# EAGLE design WiiExt (EAGLE 7.2.0)
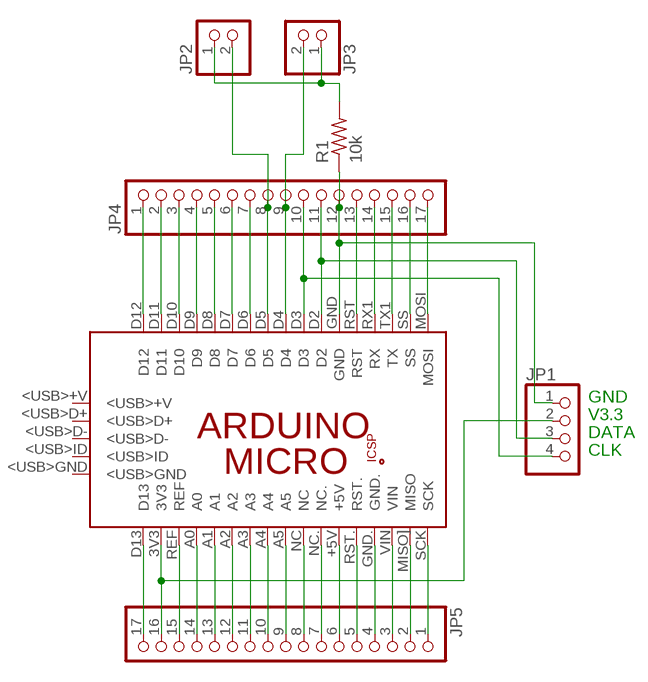
[diagram p0: schematic, sheet 1]

## Parts
JP1  PINHD-1X4  [1X04]
JP2  PINHD-1X2  [1X02]
JP3  PINHD-1X2  [1X02]
JP4  PINHD-1X17  [1X17]
JP5  PINHD-1X17  [1X17]
PCB1  ARDUINO_MICROOUTLINE  [ARDUINO_MICRO]
R1  10k  R-US_0204/7  [0204/7]

## Nets
N$1: JP1.4 JP4.10 PCB1.D3
N$2: JP1.3 JP4.11 PCB1.D2
N$3: JP1.1 JP4.12 PCB1.GND R1.1
N$4: JP1.2 JP5.16 PCB1.3V3
N$5: JP4.1 PCB1.D12
N$6: JP4.2 PCB1.D11
N$7: JP4.3 PCB1.D10
N$8: JP4.4 PCB1.D9
N$9: JP4.5 PCB1.D8
N$10: JP4.6 PCB1.D7
N$11: JP4.7 PCB1.D6
N$12: JP2.2 JP4.8 PCB1.D5
N$13: JP3.2 JP4.9 PCB1.D4
N$14: JP4.13 PCB1.RST
N$15: JP4.14 PCB1.RX1(RX)
N$16: JP4.15 PCB1.TX1(TX)
N$17: JP4.16 PCB1.SS
N$18: JP4.17 PCB1.MOSI
N$19: JP5.17 PCB1.D13
N$20: JP5.15 PCB1.REF
N$21: JP5.14 PCB1.A0
N$22: JP5.13 PCB1.A1
N$23: JP5.12 PCB1.A2
N$24: JP5.11 PCB1.A3
N$25: JP5.10 PCB1.A4
N$26: JP5.9 PCB1.A5
N$27: JP5.8 PCB1.NC
N$28: JP5.7 PCB1.NC.
N$29: JP5.6 PCB1.+5V
N$30: JP5.5 PCB1.RST.
N$31: JP5.4 PCB1.GND.
N$32: JP5.3 PCB1.VIN
N$33: JP5.2 PCB1.MISO](MISO)
N$34: JP5.1 PCB1.SCK
N$35: JP2.1 JP3.1 R1.2
Unconnected: PCB1.5V PCB1.<USB>+V PCB1.<USB>D+ PCB1.<USB>D- PCB1.<USB>GND PCB1.<USB>ID PCB1.GND_ PCB1.MISO. PCB1.MOSI. PCB1.RESET.. PCB1.SCK.

## Notes on the sheet
- GND
- V3.3
- DATA
- CLK

## Library data of the parts
JP1 = pinhead:PINHD-1X4: PIN HEADER
JP2 JP3 = pinhead:PINHD-1X2: PIN HEADER
JP4 JP5 = pinhead:PINHD-1X17: PIN HEADER
PCB1 = E14_Arduino_revB:ARDUINO_MICRO: Device for representing an Arduino Micro board with a footprint in an EAGLE design. Created by Dave Young for Element14. More EAGLE documentation at: http://www.element14.com/community/community/knode/cadsoft_eagle
R1 = resistor:R-US_: RESISTOR, American symbol

## Board
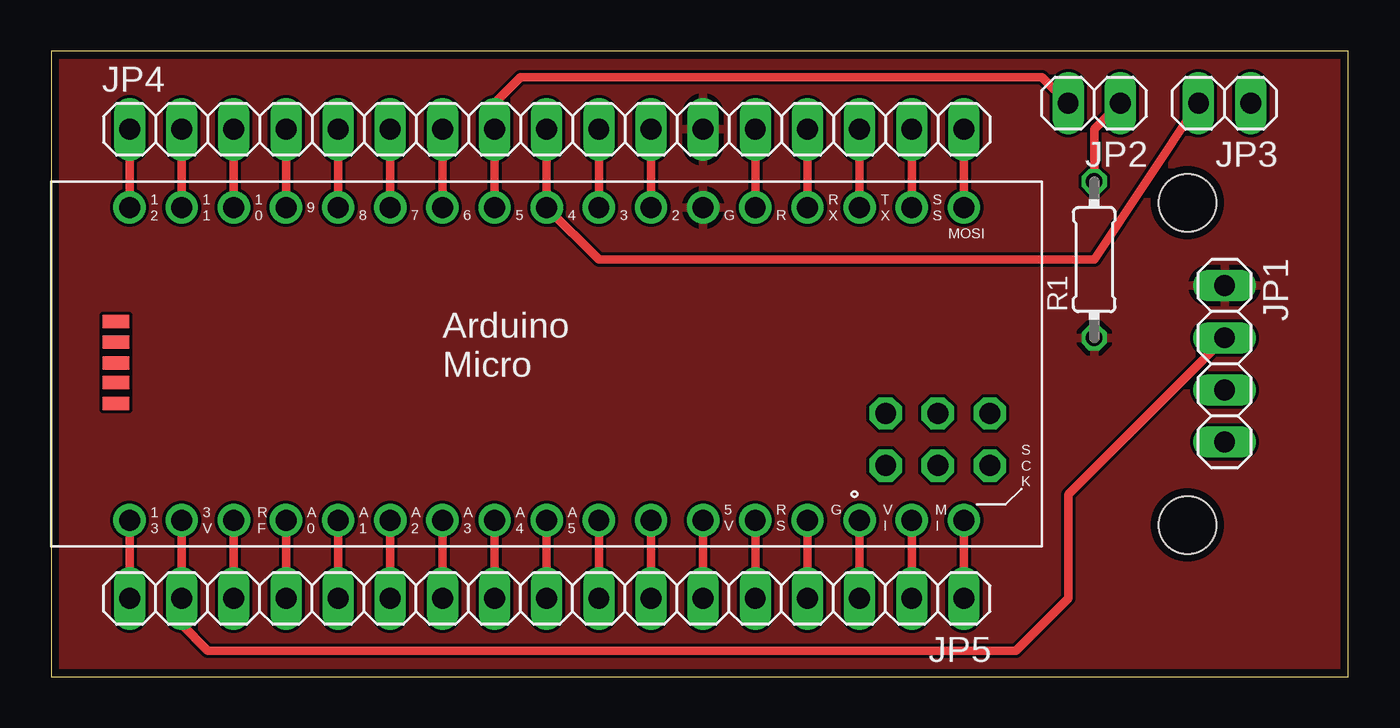
[diagram p1: board, top side]
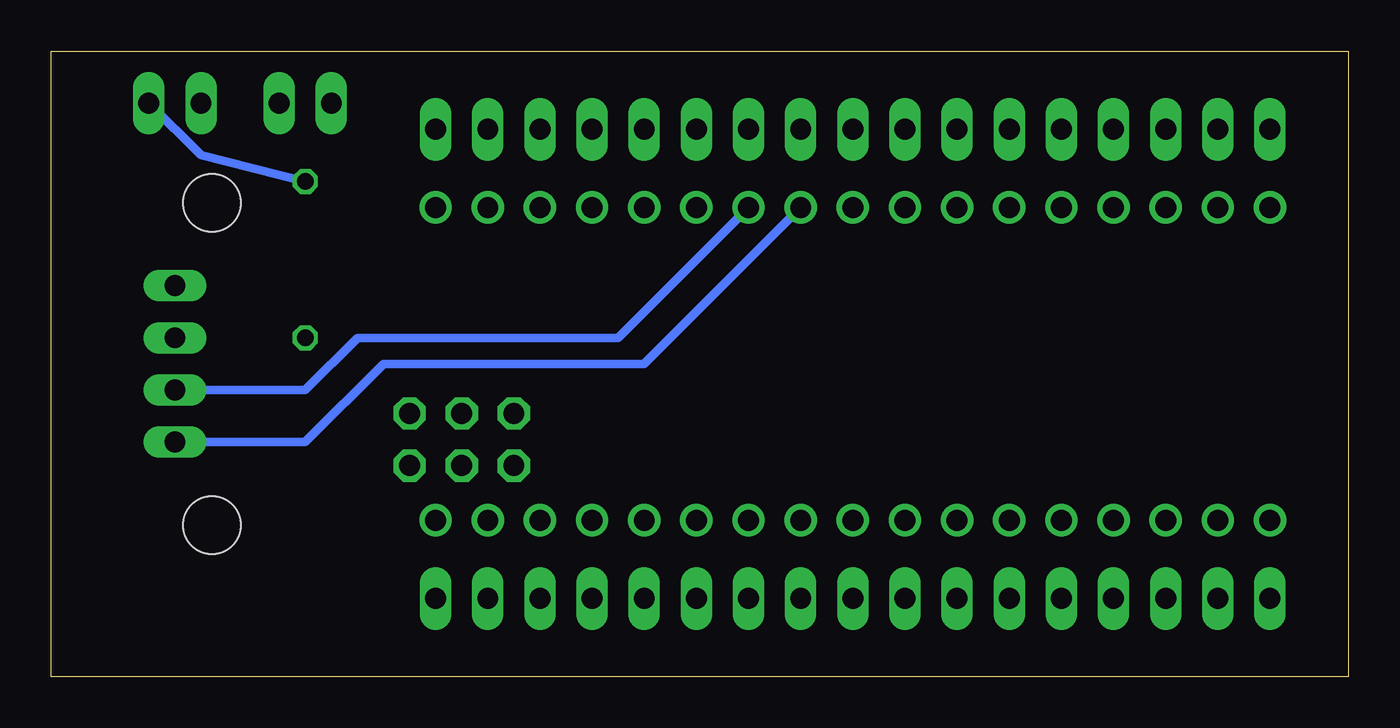
[diagram p2: board, bottom side, seen from below]

Size 63.17 x 30.47 mm. Coordinates in mm from the lower left corner, seen from the top.
Outline: 0,0 63.17,0 63.17,30.47 0,30.47 0,0
Copper layers (1*16): Top 0.0356mm / dielectric 1.5011mm / Bottom 0.0356mm
Design rules "LaenPCBOrder": minimum track width 6mil, minimum drill 13mil, track to track 6mil, track to pad 6mil, pad to pad 6mil, via to via 6mil, smd to smd 6mil, copper to edge 15mil, drill to drill 6mil, minimum pad ring 7mil, minimum via ring 7mil, stop-mask expansion 3mil, vias tented up to drill 0mil, thermal gap 10mil
Holes 2.8 mm at 55.34,23.09 55.34,7.39

### Footprints (pad centres in the part's own frame; a part is rotated, then mirrored left to right if it is on the bottom)
1X04 = drill 1.016 long: 1 -3.81,0; 2 -1.27,0; 3 1.27,0; 4 3.81,0
1X02 = drill 1.016 long: 1 -1.27,0; 2 1.27,0
1X17 = drill 1.016 long: 1 -20.32,0; 2 -17.78,0; 3 -15.24,0; 4 -12.7,0; 5 -10.16,0; 6 -7.62,0; 7 -5.08,0; 8 -2.54,0; 9 0,0; 10 2.54,0; 11 5.08,0; 12 7.62,0; 13 10.16,0; 14 12.7,0; 15 15.24,0; 16 17.78,0; 17 20.32,0
ARDUINO_MICRO = drill 1.016 pad 1.575: 3V3 6.35,1.27; +5V 31.75,1.27; A0 11.43,1.27; A1 13.97,1.27; A2 16.51,1.27; A3 19.05,1.27; A4 21.59,1.27; A5 24.13,1.27; D2 29.21,16.51; D3 26.67,16.51; D4 24.13,16.51; D5 21.59,16.51; D6 19.05,16.51; D7 16.51,16.51; D8 13.97,16.51; D9 11.43,16.51; D10 8.89,16.51; D11 6.35,16.51; D12 3.81,16.51; D13 3.81,1.27; GND 31.75,16.51; GND. 36.83,1.27; MISO] 41.91,1.27; MOSI 44.45,16.51; NC 26.67,1.27; NC. 29.21,1.27; REF 8.89,1.27; RST 34.29,16.51; RST. 34.29,1.27; RX1 36.83,16.51; SCK 44.45,1.27; SS 41.91,16.51; TX1 39.37,16.51; VIN 39.37,1.27 | drill 1.016 pad 1.575 octagon: 5V 40.64,6.477; GND_ 45.72,6.477; MISO. 40.64,3.937; MOSI. 43.18,6.477; RESET.. 45.72,3.937; SCK. 43.18,3.937 | smd 1.27 x 0.635: <USB>+V 3.15,10.947; <USB>D+ 3.15,9.957; <USB>D- 3.15,8.941; <USB>GND 3.15,6.96; <USB>ID 3.15,7.976
0204/7 = drill 0.813 octagon: 1 -3.81,0; 2 3.81,0

### Placement (x,y rotation side)
JP1  57.15,15.24 270 top
JP2  50.8,27.94 180 top
JP3  57.15,27.94 180 top
JP4  24.13,26.67 0 top
JP5  24.13,3.81 180 top
PCB1  0,6.35 0 top
R1  50.8,20.32 90 top

### Tracks (layer width: path | path; a pad name or v marks a point on that pad's centre or on a via)
N$1
  Top 0.406: JP4.10 PCB1.D3
  Bottom 0.406: PCB1.D3 34.29,15.24 46.99,15.24 50.8,11.43 JP1.4
N$2
  Top 0.406: JP4.11 PCB1.D2
  Bottom 0.406: PCB1.D2 35.56,16.51 48.26,16.51 50.8,13.97 JP1.3
N$3
  pour Top: 0,30.48 63.5,30.48 63.5,0 0,0
N$4
  Top 0.406: PCB1.3V3 JP5.16 6.35,2.54 7.62,1.27 46.99,1.27 49.53,3.81 49.53,8.89 JP1.2
N$5
  Top 0.406: JP4.1 PCB1.D12
N$6
  Top 0.406: JP4.2 PCB1.D11
N$7
  Top 0.406: JP4.3 PCB1.D10
N$8
  Top 0.406: JP4.4 PCB1.D9
N$9
  Top 0.406: JP4.5 PCB1.D8
N$10
  Top 0.406: JP4.6 PCB1.D7
N$11
  Top 0.406: JP4.7 PCB1.D6
N$12
  Top 0.406: PCB1.D5 JP4.8 21.59,27.94 22.86,29.21 48.26,29.21 JP2.2
  Bottom 0.406: 21.59,27.94 JP4.8
N$13
  Top 0.406: JP4.9 PCB1.D4 26.67,20.32 50.8,20.32 JP3.2
N$14
  Top 0.406: JP4.13 PCB1.RST
N$15
  Top 0.406: JP4.14 PCB1.RX1
N$16
  Top 0.406: JP4.15 PCB1.TX1
N$17
  Top 0.406: PCB1.SS JP4.16
N$18
  Top 0.406: JP4.17 PCB1.MOSI
N$19
  Top 0.406: JP5.17 PCB1.D13
N$20
  Top 0.406: JP5.15 PCB1.REF
N$21
  Top 0.406: JP5.14 PCB1.A0
N$22
  Top 0.406: JP5.13 PCB1.A1
N$23
  Top 0.406: JP5.12 PCB1.A2
N$24
  Top 0.406: JP5.11 PCB1.A3
N$25
  Top 0.406: JP5.10 PCB1.A4
N$26
  Top 0.406: JP5.9 PCB1.A5
N$27
  Top 0.406: JP5.8 PCB1.NC
N$28
  Top 0.406: JP5.7 PCB1.NC.
N$29
  Top 0.406: JP5.6 PCB1.+5V
N$30
  Top 0.406: JP5.5 PCB1.RST.
N$31
  Top 0.406: JP5.4 PCB1.GND.
N$32
  Top 0.406: JP5.3 PCB1.VIN
N$33
  Top 0.406: JP5.2 PCB1.MISO]
N$34
  Top 0.406: JP5.1 PCB1.SCK
N$35
  Top 0.406: JP2.1 50.8,26.67 R1.2
  Bottom 0.406: JP3.1 55.88,25.4 R1.2